# Altium schematic sheet ISOLATOR_LEVEL SHIFTER.SchDoc
size A4
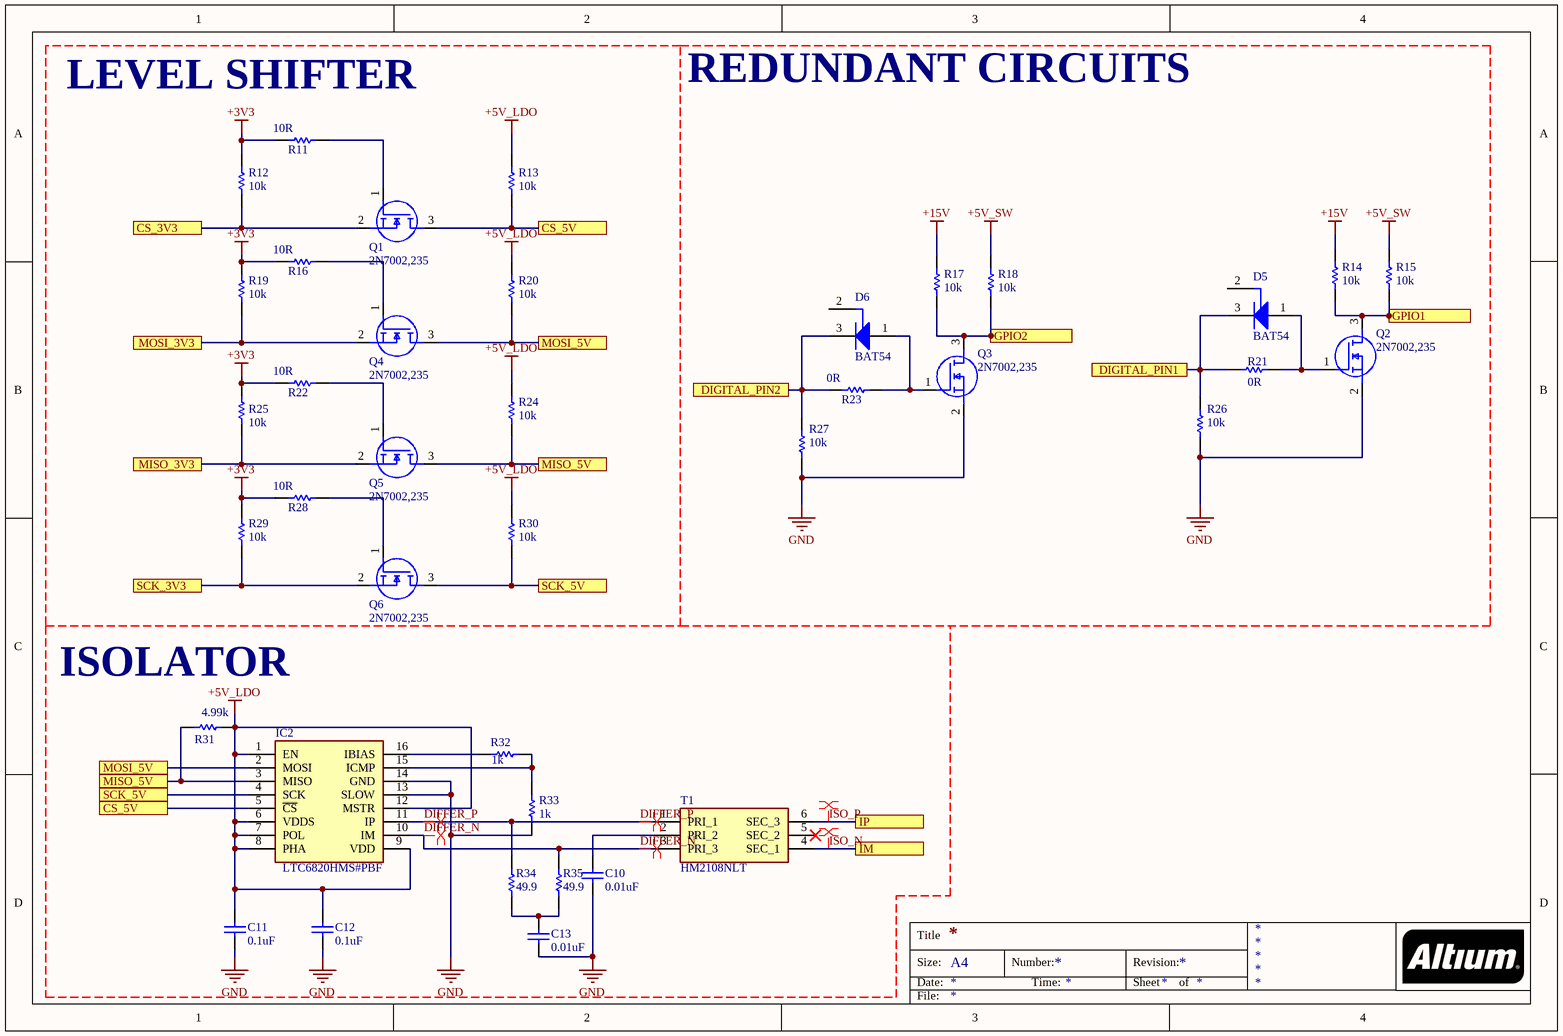
[diagram p0: ISOLATOR_LEVEL SHIFTER.SchDoc]

## Parts
C10  0.01uF  [KEMT-1206-2_N]
C11  0.1uF  [KEMT-1206-2_N]
C12  0.1uF  [KEMT-1206-2_N]
C13  0.01uF  [KEMT-1206-2_N]
D5  BAT54  [INF-SOT23_N]
D6  BAT54  [INF-SOT23_N]
IC2  LTC6820HMS#PBF  [ltc6820]
Q1  2N7002,235  [SOT95P230X110-3N]
Q2  2N7002,235  [SOT95P230X110-3N]
Q3  2N7002,235  [SOT95P230X110-3N]
Q4  2N7002,235  [SOT95P230X110-3N]
Q5  2N7002,235  [SOT95P230X110-3N]
Q6  2N7002,235  [SOT95P230X110-3N]
R11  10R  [RESC3216X60X45NL10T20 - duplicate]
R12  10k  [RESC3216X60X45NL10T20 - duplicate]
R13  10k  [RESC3216X60X45NL10T20 - duplicate]
R14  10k  [RESC3216X60X45NL10T20 - duplicate]
R15  10k  [RESC3216X60X45NL10T20 - duplicate]
R16  10R  [RESC3216X60X45NL10T20 - duplicate]
R17  10k  [RESC3216X60X45NL10T20 - duplicate]
R18  10k  [RESC3216X60X45NL10T20 - duplicate]
R19  10k  [RESC3216X60X45NL10T20 - duplicate]
R20  10k  [RESC3216X60X45NL10T20 - duplicate]
R21  0R  [RESC3216X60X45NL10T20 - duplicate]
R22  10R  [RESC3216X60X45NL10T20 - duplicate]
R23  0R  [RESC3216X60X45NL10T20 - duplicate]
R24  10k  [RESC3216X60X45NL10T20 - duplicate]
R25  10k  [RESC3216X60X45NL10T20 - duplicate]
R26  10k  [RESC3216X60X45NL10T20 - duplicate]
R27  10k  [RESC3216X60X45NL10T20 - duplicate]
R28  10R  [RESC3216X60X45NL10T20 - duplicate]
R29  10k  [RESC3216X60X45NL10T20 - duplicate]
R30  10k  [RESC3216X60X45NL10T20 - duplicate]
R31  4.99k  [RESC3216X60X45NL10T20 - duplicate]
R32  1k  [RESC3216X60X45NL10T20 - duplicate]
R33  1k  [RESC3216X60X45NL10T20 - duplicate]
R34  49.9  [RESC3216X60X45NL10T20 - duplicate]
R35  49.9  [RESC3216X60X45NL10T20 - duplicate]
T1  HM2108NLT  [HM2108NLT]

## Blocks framed on the sheet
LEVEL SHIFTER: Q1 Q4-Q6 R11-R13 R16 R19 R20 R22 R24 R25 R28-R30

## Ports
CS_3V3, CS_5V, DIGITAL_PIN1, DIGITAL_PIN2, GPIO1, GPIO2, IM, IP, MISO_3V3, MISO_5V, MOSI_3V3, MOSI_5V, SCK_3V3, SCK_5V

## Nets
+3V3: R11.2 R12.2 R16.2 R19.2 R22.2 R25.2 R28.2 R29.2
+5V_LDO: C11.2 C12.2 IC2.1(EN) IC2.6(VDDS) IC2.7(POL) IC2.8(PHA) IC2.9(VDD) IC2.12(MSTR) R13.2 R20.2 R24.2 R30.2 R31.1
+5V_SW: R15.1 R18.1
+15V: R14.1 R17.1
GND: C10.1 C11.1 C12.1 C13.1 IC2.13(SLOW) IC2.14(GND) Q2.2(S) Q3.2(S) R26.1 R27.1 R33.1
CS_3V3: Q1.2(S) R12.1 ; port CS_3V3
CS_5V: IC2.5(~{CS}) Q1.3(D) R13.1 ; port CS_5V
DIFFER_N: IC2.10(IM) R35.1 T1.3(PRI_3)
DIFFER_P: IC2.11(IP) R34.1 T1.1(PRI_1)
DIGITAL_PIN1: D5.3(K) R21.2 R26.2 ; port DIGITAL_PIN1
DIGITAL_PIN2: D6.3(K) R23.2 R27.2 ; port DIGITAL_PIN2
GPIO1: Q2.3(D) R14.2 R15.2 ; port GPIO1
GPIO2: Q3.3(D) R17.2 R18.2 ; port GPIO2
ISO_N: T1.4(SEC_1) ; port IM
ISO_P: T1.6(SEC_3) ; port IP
MISO_3V3: Q5.2(S) R25.1 ; port MISO_3V3
MISO_5V: IC2.3(MISO) Q5.3(D) R24.1 R31.2 ; port MISO_5V
MOSI_3V3: Q4.2(S) R19.1 ; port MOSI_3V3
MOSI_5V: IC2.2(MOSI) Q4.3(D) R20.1 ; port MOSI_5V
SCK_3V3: Q6.2(S) R29.1 ; port SCK_3V3
SCK_5V: IC2.4(SCK) Q6.3(D) R30.1 ; port SCK_5V
NetC10_2: C10.2 T1.2(PRI_2)
NetC13_2: C13.2 R34.2 R35.2
NetD5_1: D5.1(A) Q2.1(G) R21.1
NetD6_1: D6.1(A) Q3.1(G) R23.1
NetIC2_15: IC2.15(ICMP) R32.1 R33.2
NetIC2_16: IC2.16(IBIAS) R32.2
NetQ1_1: Q1.1(G) R11.1
NetQ4_1: Q4.1(G) R16.1
NetQ5_1: Q5.1(G) R22.1
NetQ6_1: Q6.1(G) R28.1

Not connected (* = marked no-connect by the designer): D5 2(NC); D6 2(NC); T1 5(SEC_2)*

## Layout directives
differential pair: DIFFER_N, DIFFER_P, ISO_N, ISO_P

## Notes on the sheet
- REDUNDANT CIRCUITS
- (near R31) ISOLATOR
- Title
- Size:
- Date:
- A4
- Number:
- Time:
- Revision:
- Sheet
- of
- File:

## Library data of the parts
C10-C13 = CMP-1037-04202-2: CAP, Ceramic, 0.1 uF, +/- 10%, 50 V, -55 to 125 degC, 1206 (3216 Metric), RoHS, Tape and Reel; Manufacturer: Kemet; Voltage Rating: 50V; Capacitance: 0.1µF; Product Range: KEMET-CSeries; SVHC: ToBeAdvised; Dielectric Characteristic: X7R; Capacitor Case Style: 1206[3216Metric]; Package Reference: 1206-2; Package Description: 2-Leads SMD, Body 3.2 x 1.6 mm; Packaging: Tape&Reel; Operating Temperature Max: 125degC; Capacitance Tolerance: ±10%; Datasheet URL: https://datasheet.ciiva.com/6125/1725438-6125494.pdf; Manufacturer URL: http://www.kemet.com/; Operating Temperature Min: -55degC; Datasheet Version: Jul-13
D5 D6 = CMP-1182-00010-1: Silicon Schottky Diode, SOT23, Reel, Green; Manufacturer: Infineon; VF (max): 800Â mV; Configuration: Single; IF (max): 200Â mA; CT (max): 10Â pF; Green: TRUE; VR (max): 30Â V; PartNumber: BAT54; ComponentLink2URL: http://www.infineon.com/dgdl/bat54series.pdf?folderId=db3a30431400ef68011425f1ca2505e3&fileId=db3a304314dca3890115190b74210ea6; ComponentLink3Description: Package Specification; PackageVersion: Apr-08; PackageDescription: 3-Pin Small Outline Transistor Package, 1.3 x 2.9 mm Body, 0.95 mm Pitch; ComponentLink1Description: Manufacturer URL; ComponentLink1URL: http://www.infineon.com/; Mounting Technology: Surface Mount; Packing: Reel; ComponentLink2Description: Datasheet; PackageReference: SOT23; ComponentLink3URL: http://www.infineon.com/dgdl/SOT23-Package_Overview.pdf?folderId=db3a30431936bc4b0119532290053c66&fileId=db3a30431936bc4b0119533468123c85
IC2 = LTC6820HMS#PBF: Integrated Circuit; Manufacturer_Name: Analog Devices; Datasheet Link: https://www.analog.com/media/en/technical-documentation/data-sheets/LTC6820.pdf; Height: 1.1mm; Manufacturer_Part_Number: LTC6820HMS#PBF; Mouser Part Number: 584-LTC6820HMS#PBF; Mouser Price/Stock: https://www.mouser.co.uk/ProductDetail/Analog-Devices/LTC6820HMSPBF?qs=hVkxg5c3xu%252BAhS55eUb%252BEQ%3D%3D; Arrow Part Number: LTC6820HMS#PBF; Arrow Price/Stock: https://www.arrow.com/en/products/ltc6820hmspbf/analog-devices?region=nac
Q1-Q6 = 2N7002,235: MOSFET (N-Channel); Manufacturer_Name: Nexperia; Datasheet Link: https://assets.nexperia.com/documents/data-sheet/2N7002.pdf; Height: 1.1mm; Manufacturer_Part_Number: 2N7002,235; Mouser Part Number: 771-2N7002235; Mouser Price/Stock: https://www.mouser.co.uk/ProductDetail/Nexperia/2N7002235?qs=AX3SRYwdf7Gv59FeQZ%2FkYw%3D%3D; Arrow Part Number: 2N7002,235; Arrow Price/Stock: https://www.arrow.com/en/products/2n7002235/nexperia
R11-R35 = CMP-2003-02213-1: Part Number: CRCW120647K0FKEA; Manufacturer: Vishay Dale
T1 = HM2108NLT: Transformer; Manufacturer_Name: Pulse; Datasheet Link: https://productfinder.pulseeng.com/doc_type/WEB301/doc_num/HM2108NL/doc_part/HM2108NL.pdf; Height: 5.75mm; Manufacturer_Part_Number: HM2108NLT; Mouser Part Number: 673-HM2108NLT; Mouser Price/Stock: https://www.mouser.com/Search/Refine.aspx?Keyword=673-HM2108NLT